# Altium schematic sheet CURRENT_SENSE.SchDoc
size A4
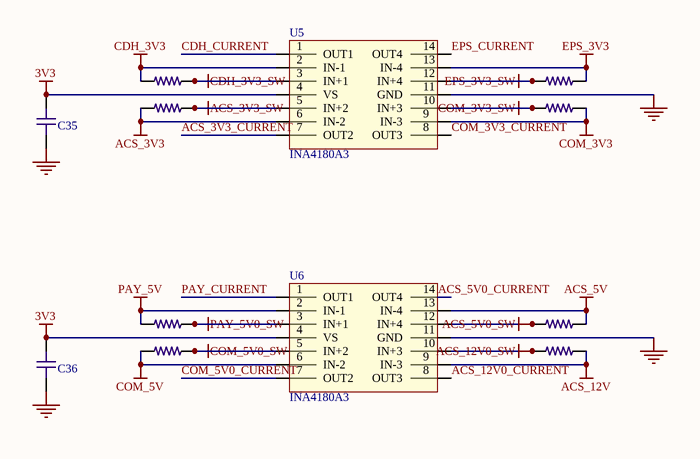
[diagram p0: CURRENT_SENSE.SchDoc]

## Parts
C35  Capacitor  [C0603-IPC]  (value not drawn)
C36  Capacitor  [C0603-IPC]  (value not drawn)
R16  2512 Template  [R2512-IPC]  (value not drawn)
R17  2512 Template  [R2512-IPC]  (value not drawn)
R18  2512 Template  [R2512-IPC]  (value not drawn)
R19  2512 Template  [R2512-IPC]  (value not drawn)
R20  2512 Template  [R2512-IPC]  (value not drawn)
R21  2512 Template  [R2512-IPC]  (value not drawn)
R22  2512 Template  [R2512-IPC]  (value not drawn)
R23  2512 Template  [R2512-IPC]  (value not drawn)
U5  INA4180A3  [TSSOP14]
U6  INA4180A3  [TSSOP14]

## Nets
3V3: C35.2 C36.2 U5.4(VS) U6.4(VS)
ACS_3V3: R18.1 U5.6(IN-2)
ACS_3V3_SW: R18.2 U5.5(IN+2)
ACS_5V: R21.2 U6.13(IN-4)
ACS_5V0_SW: R21.1 U6.12(IN+4)
ACS_12V: R23.2 U6.9(IN-3)
ACS_12V0_SW: R23.1 U6.10(IN+3)
CDH_3V3: R16.1 U5.2(IN-1)
CDH_3V3_SW: R16.2 U5.3(IN+1)
COM_3V3: R19.2 U5.9(IN-3)
COM_3V3_SW: R19.1 U5.10(IN+3)
COM_5V: R22.1 U6.6(IN-2)
COM_5V0_SW: R22.2 U6.5(IN+2)
EPS_3V3: R17.2 U5.13(IN-4)
EPS_3V3_SW: R17.1 U5.12(IN+4)
GND: C35.1 C36.1 U5.11(GND) U6.11(GND)
PAY_5V: R20.1 U6.2(IN-1)
PAY_5V0_SW: R20.2 U6.3(IN+1)
ACS_3V3_CURRENT: U5.7(OUT2)
ACS_5V0_CURRENT: U6.14(OUT4)
ACS_12V0_CURRENT: U6.8(OUT3)
CDH_CURRENT: U5.1(OUT1)
COM_3V3_CURRENT: U5.8(OUT3)
COM_5V0_CURRENT: U6.7(OUT2)
EPS_CURRENT: U5.14(OUT4)
PAY_CURRENT: U6.1(OUT1)

## Library data of the parts
C35 C36 = 13: Chip Capacitor, 0603, 100nF, 10V, X7R; OrbitPartId: 13; Type: Passive; EIA Code: X7R; Max. Voltage: 10V; Value: 100nF; PartId: 1; Subtype: Capacitor
R16-R23 = 2512 Template: Chip Resistor, 2512, 30 mohms; Value: 0.03
U5 U6 = INA4180: INA4180 4 channel current sense IC. A3(100 V/V); ComponentLink1Description: Datasheet; ComponentLink1URL: http://www.ti.com/lit/ds/symlink/ina4180.pdf